# EAGLE design i2c-splitter (EAGLE 6.3)
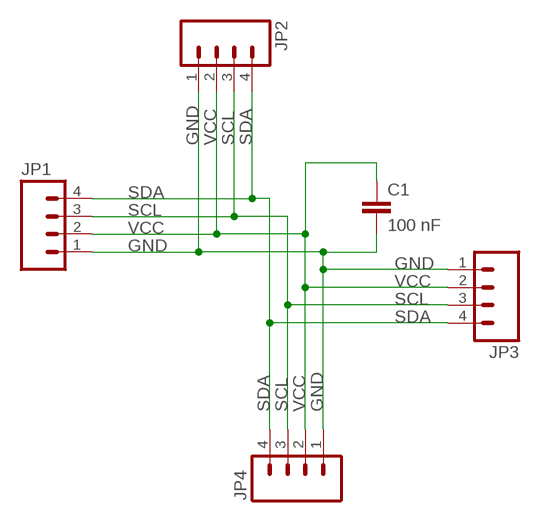
[diagram p0: schematic, sheet 1]

## Parts
C1  100 nF  C-EUC0805  [C0805]
JP1  M04PTH  [1X04]
JP2  M04PTH  [1X04]
JP3  M04PTH  [1X04]
JP4  M04PTH  [1X04]

## Nets
GND: C1.2 JP1.1 JP2.1 JP3.1 JP4.1
SCL: JP1.3 JP2.3 JP3.3 JP4.3
SDA: JP1.4 JP2.4 JP3.4 JP4.4
VCC: C1.1 JP1.2 JP2.2 JP3.2 JP4.2

## Library data of the parts
C1 = resistor:C-EU: CAPACITOR, European symbol
JP1-JP4 = SparkFun:M04: Header 4 Standard 4-pin 0.1" header. Use with straight break away headers (SKU : PRT-00116), right angle break away headers (PRT-00553), swiss pins (PRT-00743), machine pins (PRT-00117), and female headers (PRT-00115). Molex polarized connector foot print use with SKU : PRT-08231 with associated crimp pins and housings. 1MM SMD Version SKU: PRT-10208

## Board
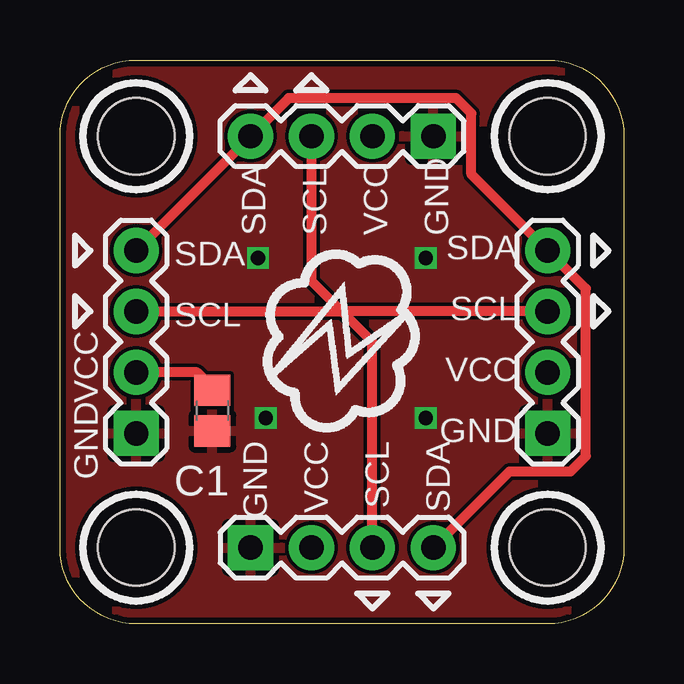
[diagram p1: board, top side]
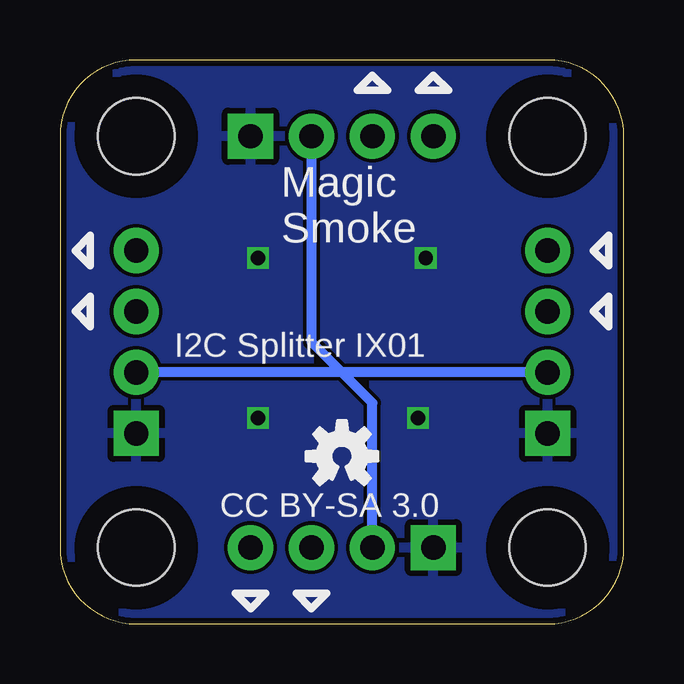
[diagram p2: board, bottom side, seen from below]

Size 23.5 x 23.5 mm. Coordinates in mm from the lower left corner, seen from the top.
Outline: 0,3.17 0,20.32 arc-90 3.17,23.5 20.32,23.5 arc-90 23.5,20.32 23.5,3.17 arc-90 20.32,0 3.17,0 arc-90 0,3.17
Copper layers (1*2*15*16): Top 0.035mm / dielectric 0.2mm / layer 2 0.0175mm / dielectric 1.1mm / layer 15 0.0175mm / dielectric 0.2mm / Bottom 0.035mm
Design rules "SeeedStudio_DRU_no_angle_20130527": minimum track width 6mil, minimum drill 12mil, track to track 6mil, track to pad 6mil, pad to pad 6mil, via to via 6mil, smd to smd 0mil, copper to edge 10mil, drill to drill 10mil, minimum pad ring 6mil, minimum via ring 6mil, stop-mask expansion 2mil, vias tented up to drill 25mil, thermal gap 10mil
Holes 3.17 mm at 3.17,3.17 3.17,20.32 20.32,3.17 20.32,20.32
tRestrict: area 0.6,17.8 to 5.7,22.9; area 17.8,17.8 to 22.9,22.9; area 0.6,0.6 to 5.7,5.7; area 17.8,0.6 to 22.9,5.7
bRestrict: area 0.6,17.8 to 5.7,22.9; area 17.8,17.8 to 22.9,22.9; area 0.6,0.6 to 5.7,5.7; area 17.8,0.6 to 22.9,5.7

### Footprints (pad centres in the part's own frame; a part is rotated, then mirrored left to right if it is on the bottom)
C0805 = smd 1.3 x 1.5: 1 -0.85,0; 2 0.85,0
1X04 = drill 1.016 pad 1.88 square: 1 0,0 | drill 1.016 pad 1.88: 2 2.54,0; 3 5.08,0; 4 7.62,0

### Placement (x,y rotation side)
C1  6.35,8.89 270 top
JP1  3.17,7.94 90 top
JP2  15.56,20.32 180 top
JP3  20.32,7.94 90 top
JP4  7.94,3.17 0 top
U$1  [OSHW-LOGO-S]  11.75,6.99 0 bottom

### Tracks (layer width: path | path; a pad name or v marks a point on that pad's centre or on a via)
GND  (via drill 0.6)
  other vias: 15.24,8.57 8.57,8.57 15.24,15.24 8.26,15.24
  pour Bottom: -0.64,-0.64 -0.64,24.13 24.13,24.13 24.13,-0.64
  pour Top: -1.27,-1.27 -1.27,24.77 24.77,24.77 24.77,-1.27
SCL
  Top 0.406: JP2.3 10.48,14.29 11.75,13.02 | JP4.3 13.02,11.75 11.75,13.02 | JP1.3 11.75,13.02 | JP3.3 11.75,13.02
SDA
  Top 0.406: JP4.4 18.73,6.35 21.27,6.35 21.91,6.99 21.91,13.97 JP3.4 17.14,18.73 17.14,21.27 16.51,21.91 9.53,21.91 JP2.4 JP1.4
VCC
  Top 0.406: C1.1 6.45,9.74 5.71,10.48 JP1.2
  Bottom 0.406: JP1.2 11.75,10.48 | 11.75,10.48 JP3.2 | JP4.2 10.48,9.21 11.75,10.48 | JP2.2 13.02,11.75 11.75,10.48

### Text on the board
tPlace: SDA | SCL | VCC | GND | SDA | SDA | SCL | SCL | VCC | VCC | GND | GND | VCC | SCL | SDA | GND
bPlace: Magic | Smoke | I2C Splitter IX01 | CC BY-SA 3.0